# Altium schematic sheet OSCILLAR_HFB_V1p0_MIX.SchDoc
size A4; SheetNumber: 10; SheetTotal: 13; Title_: Mixer
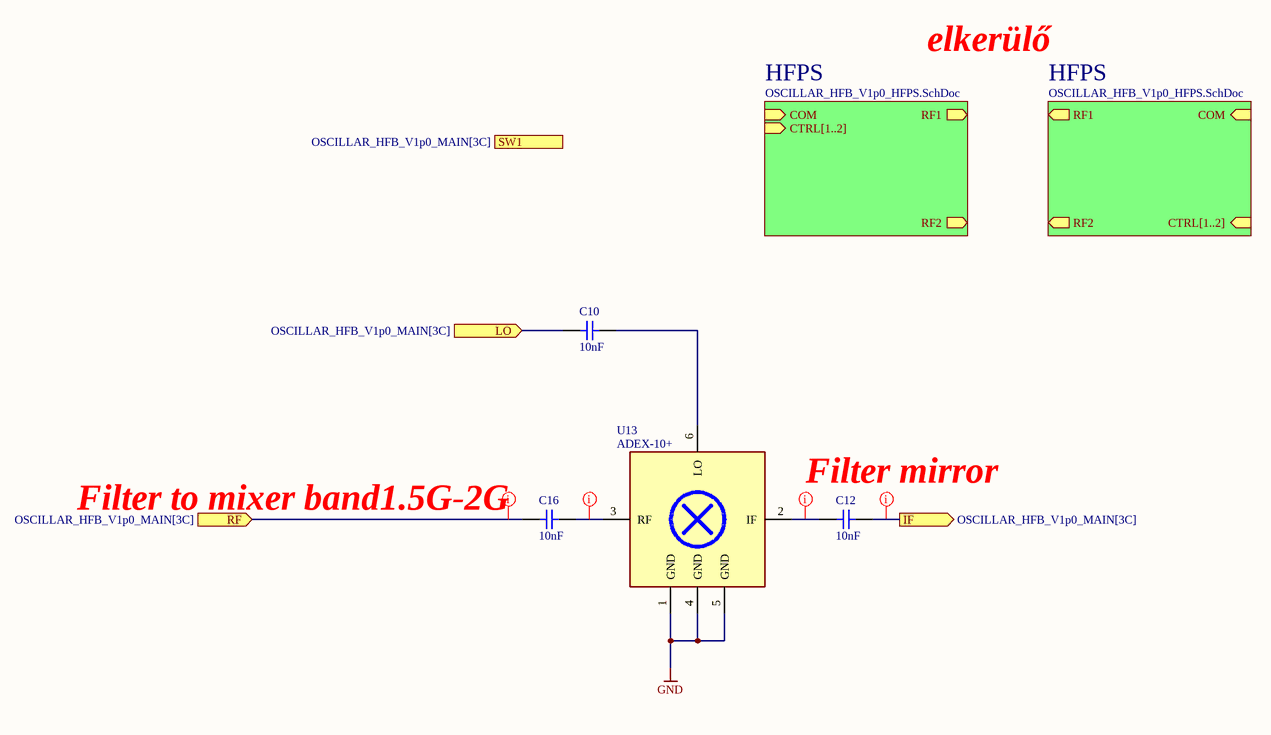
[diagram p0: OSCILLAR_HFB_V1p0_MIX.SchDoc]

## Parts
C10  10nF  [CAP_0603]
C12  10nF  [CAP_0603]
C16  10nF  [CAP_0603]
U13  ADEX-10+  [CD542]

## Sub-sheets
HFPS = OSCILLAR_HFB_V1p0_HFPS.SchDoc: COM (in), RF1 (out), CTRL[1..2] (in), RF2 (out)
HFPS = OSCILLAR_HFB_V1p0_HFPS.SchDoc: RF1 (out), CTRL[1..2] (in), COM (in), RF2 (out)

## Ports
IF (out, see OSCILLAR_HFB_V1p0_MAIN[3C]), LO (in, see OSCILLAR_HFB_V1p0_MAIN[3C]), RF (in, see OSCILLAR_HFB_V1p0_MAIN[3C]), SW1 (in, see OSCILLAR_HFB_V1p0_MAIN[3C])

## Nets
GND: U13.1(GND) U13.4(GND) U13.5(GND)
IF: C12.1 ; port IF
LO: C10.2 ; port LO
RF: C16.2 ; port RF
NetC10_1: C10.1 U13.6(LO)
NetC12_2: C12.2 U13.2(IF)
NetC16_1: C16.1 U13.3(RF)

## Layout directives
net class 50R: IF, NetC12_2, NetC16_1, RF

## Notes on the sheet
- elkerülő
- (near C16) Filter to mixer band1.5G-2G
- Filter mirror
- Board:
- Author:
- Title:
- Project:
- SVN:
- Version:
- Sheet:
- of
- Contact:
- Modified:
- Size:
- A4

## Library data of the parts
C10 C12 C16 = NP-CAPACITOR: MLCC capacitor; Type: CAP
U13 = ADEX-10+: RF Mixer DBL BAL MIX, 10M-1GHz, +7dBm LO; Part number: 139-ADEX-10; ComponentLink1Description: Datasheet; ComponentLink1URL: ADEX_10_2b-1700108.pdf; Supplier: Mouser; ComponentLink2Description: Order; ComponentLink2URL: https://hu.mouser.com/ProductDetail/Mini-Circuits/ADEX-10%2b?qs=xZ%2FP%252Ba9zWqbGpVVDMCAMpA%3D%3D; Type: IC